# EAGLE design IR_linebot_final (EAGLE 5.06)
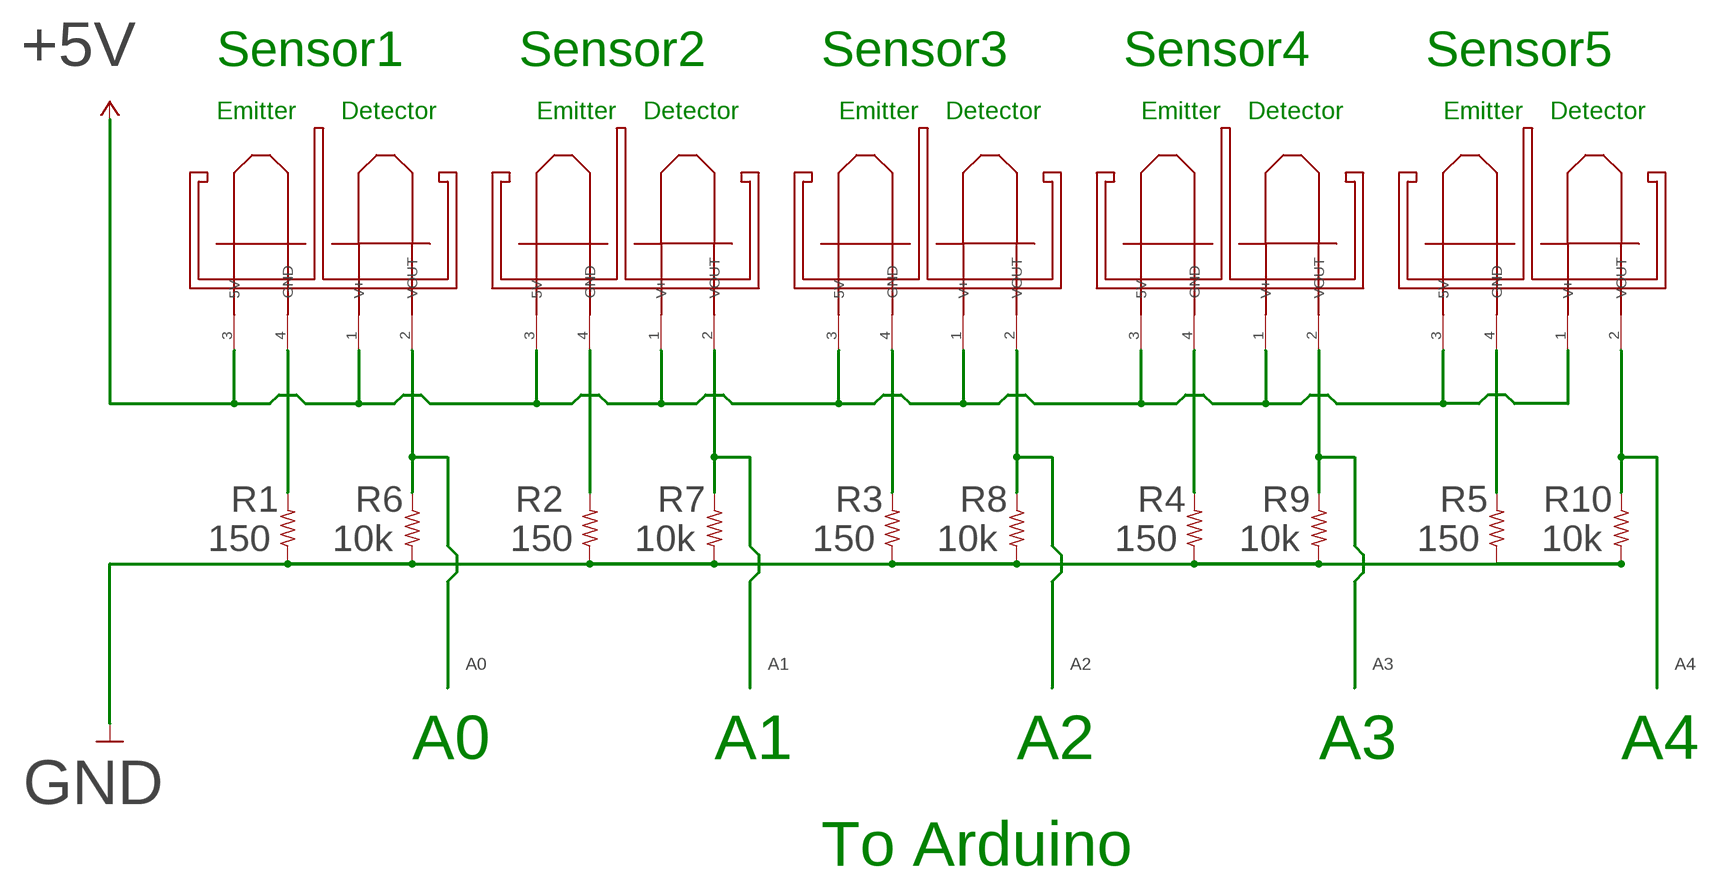
[diagram p0: schematic, sheet 1]

## Parts
IR1  IR_PAIR1  [IR_1]
IR2  IR_PAIR1  [IR_1]
IR3  IR_PAIR1  [IR_1]
IR4  IR_PAIR1  [IR_1]
IR5  IR_PAIR1  [IR_1]
R1  150  R-US_0204/7  [0204/7]
R2  150  R-US_0204/7  [0204/7]
R3  150  R-US_0204/7  [0204/7]
R4  150  R-US_0204/7  [0204/7]
R5  150  R-US_0204/7  [0204/7]
R6  10k  R-US_0204/7  [0204/7]
R7  10k  R-US_0204/7  [0204/7]
R8  10k  R-US_0204/7  [0204/7]
R9  10k  R-US_0204/7  [0204/7]
R10  10k  R-US_0204/7  [0204/7]

## Nets
+5V: IR1.1(V+) IR1.3(5V) IR2.1(V+) IR2.3(5V) IR3.1(V+) IR3.3(5V) IR4.1(V+) IR4.3(5V) IR5.1(V+) IR5.3(5V)
A0: IR1.2(VOUT) R6.1
A1: IR2.2(VOUT) R7.1
A2: IR3.2(VOUT) R8.1
A3: IR4.2(VOUT) R9.1
A4: IR5.2(VOUT) R10.1
GND: R1.1 R2.1 R3.1 R4.1 R5.1 R6.2 R7.2 R8.2 R9.2 R10.2
N$1: IR1.4(GND) R1.2
N$2: IR2.4(GND) R2.2
N$3: IR3.4(GND) R3.2
N$4: IR4.4(GND) R4.2
N$5: IR5.4(GND) R5.2

## Notes on the sheet
- Sensor1 | Sensor2 | Sensor3 | Sensor4 | Sensor5
- Emitter | Detector | Emitter | Detector | Emitter | Detector | Emitter | Detector | Emitter | Detector
- A0 | A1 | A2 | A3 | A4
- To Arduino

## Library data of the parts
IR1-IR5 = A-JD3:IR_PAIR1
R1-R10 = resistor:R-US_: RESISTOR, American symbol

## Board
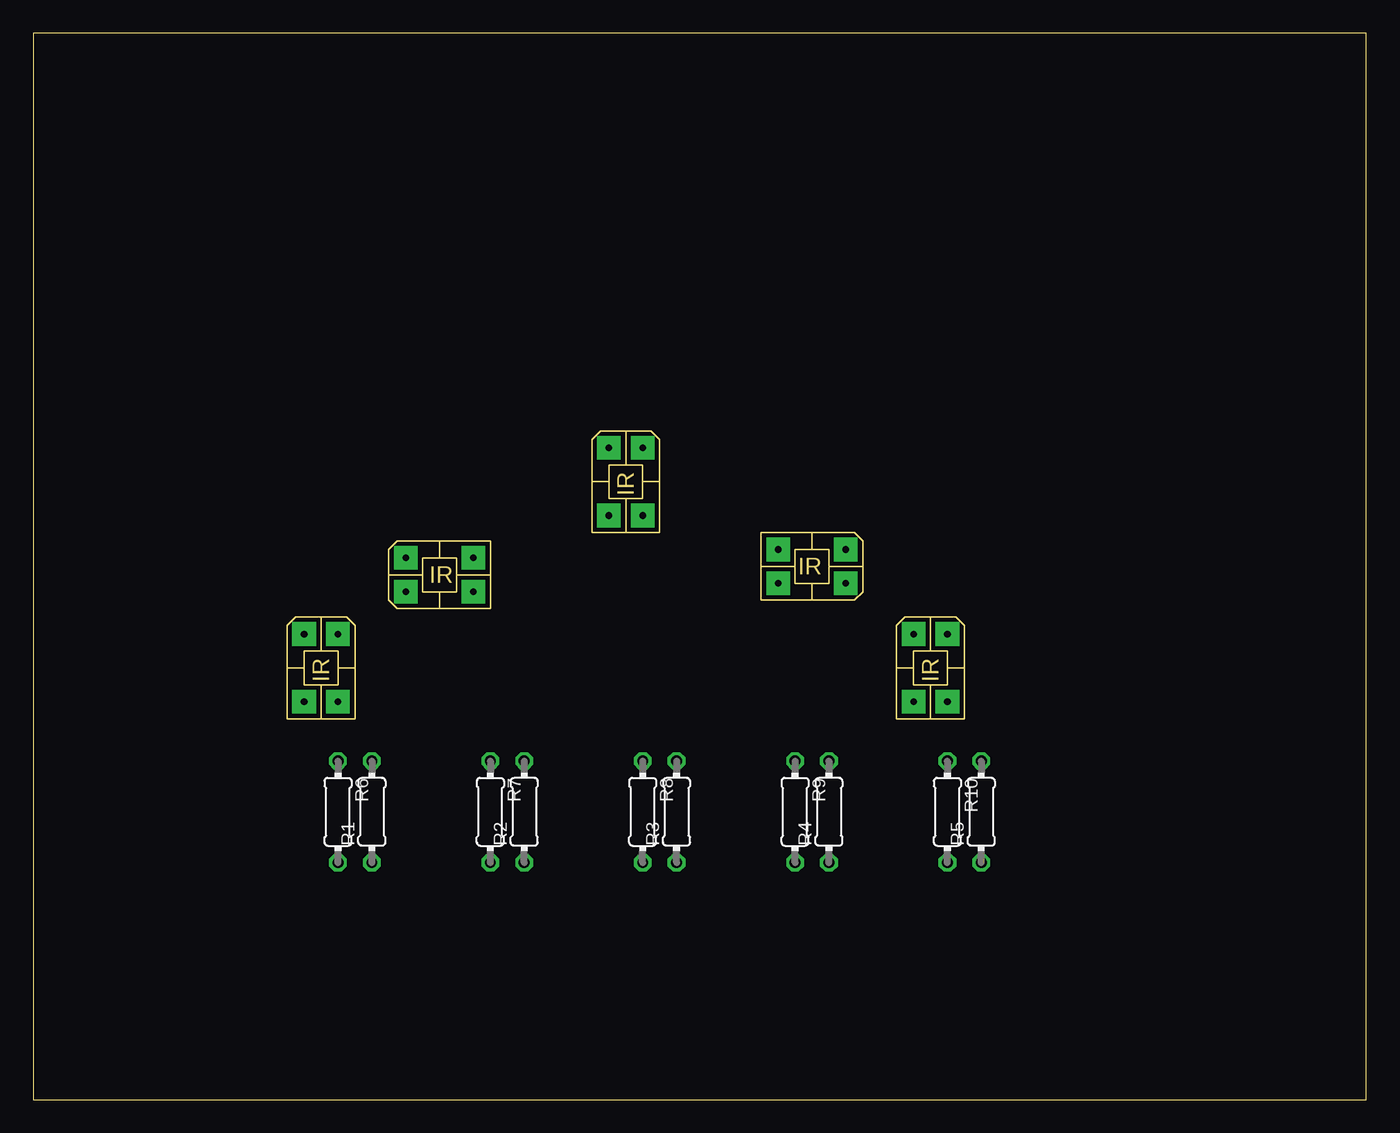
[diagram p1: board, top side]
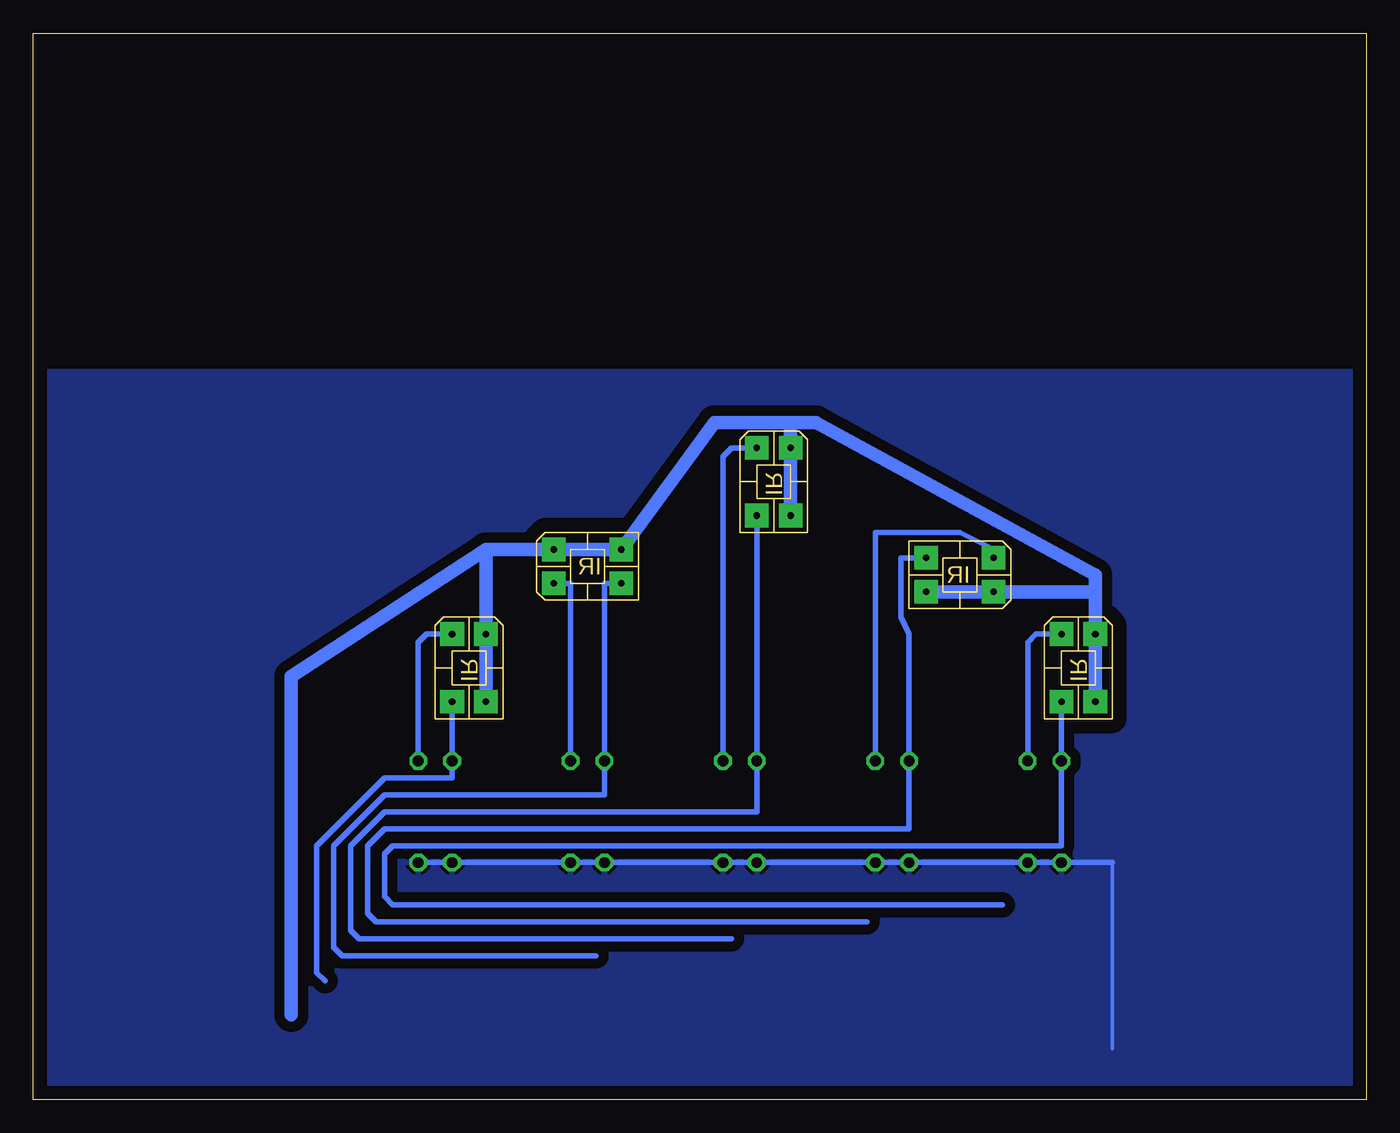
[diagram p2: board, bottom side, seen from below]

Size 100 x 80 mm. Coordinates in mm from the lower left corner, seen from the top.
Outline: 0,0 100,0 100,80 0,80 0,0
Copper layers (1*16): Top 0.035mm / dielectric 1.5mm / Bottom 0.035mm
Design rules "default *": minimum track width 10mil, minimum drill 24mil, track to track 30mil, track to pad 30mil, pad to pad 8mil, via to via 8mil, smd to smd 8mil, copper to edge 40mil, drill to drill 8mil, minimum pad ring 10mil, minimum via ring 8mil, stop-mask expansion 4mil, vias tented up to drill 0mil, thermal gap 10mil

### Footprints (pad centres in the part's own frame; a part is rotated, then mirrored left to right if it is on the bottom)
IR_1 = drill 0.5 pad 1.778 square: 1 -2.54,1.27; 2 -2.54,-1.27; 3 2.54,1.27; 4 2.54,-1.27
0204/7 = drill 0.813 octagon: 1 -3.81,0; 2 3.81,0

### Placement (x,y rotation side)
IR1  21.59,32.38 90 top
IR2  30.48,39.37 180 top
IR3  44.45,46.35 90 top
IR4  58.42,40.01 0 top
IR5  67.31,32.38 90 top
R1  25.4,21.59 90 top
R2  36.83,21.59 90 top
R3  48.26,21.59 90 top
R4  59.69,21.59 90 top
R5  71.12,21.59 90 top
R6  22.86,21.59 270 top
R7  34.29,21.59 270 top
R8  45.72,21.59 270 top
R9  57.15,21.59 270 top
R10  68.58,21.59 270 top

### Tracks (layer width: path | path; a pad name or v marks a point on that pad's centre or on a via)
+5V
  Bottom 0.813: IR2.3 IR2.1 | IR4.1 IR4.3 | IR5.3 IR5.1
  Bottom 1.016: IR1.1 IR1.3 20.32,38.1 | IR2.1 IR2.3 20.32,38.1 | IR3.1 IR3.3 43.18,50.8 41.27,50.8 | IR4.1 IR4.3 | IR5.1 IR5.3 66.04,41.27 | 41.27,50.8 20.32,39.37 20.32,38.1 | 41.27,50.8 48.9,50.8 IR4.1 | IR4.3 66.04,41.27 | IR4.1 IR4.3 | 80.64,6.35 80.64,31.75 66.04,41.27
A0
  Bottom 0.406: 27.3,14.61 73.03,14.61 73.66,15.24 73.66,18.41 73.03,19.05 22.86,19.05 R6.1 IR1.2
A1
  Bottom 0.406: 37.47,13.34 74.3,13.34 74.93,13.97 74.93,19.05 73.66,20.32 34.29,20.32 R7.1 34.29,34.92 34.92,36.2 34.92,40.64 IR2.2
A2
  Bottom 0.406: 47.62,12.06 75.56,12.06 76.2,12.7 76.2,19.05 73.66,21.59 45.72,21.59 R8.1 IR3.2
A3
  Bottom 0.406: 57.78,10.79 76.83,10.79 77.47,11.43 77.47,19.05 73.66,22.86 57.15,22.86 R9.1 57.15,38.73 IR4.2
A4
  Bottom 0.406: 78.11,8.89 78.74,9.53 78.74,19.05 73.66,24.13 68.58,24.13 R10.1 IR5.2
GND
  Bottom 0.254: 19.05,3.81 19.05,17.78
  Bottom 0.406: R5.1 R10.2 R4.1 R9.2 R3.1 R8.2 R2.1 R7.2 R1.1 R6.2 19.05,17.78
  pour Bottom: 0.64,54.61 99.06,54.61 99.06,0.64 0.64,0.64
N$1
  Bottom 0.406: R1.2 25.4,34.29 24.77,34.92 IR1.4
N$2
  Bottom 0.406: R2.2 36.83,42.55 30.48,42.55 27.94,41.27 IR2.4
N$3
  Bottom 0.406: R3.2 48.26,48.26 47.62,48.9 IR3.4
N$4
  Bottom 0.406: R4.2 59.69,38.73 IR4.4
N$5
  Bottom 0.406: R5.2 71.12,34.29 70.48,34.92 IR5.4